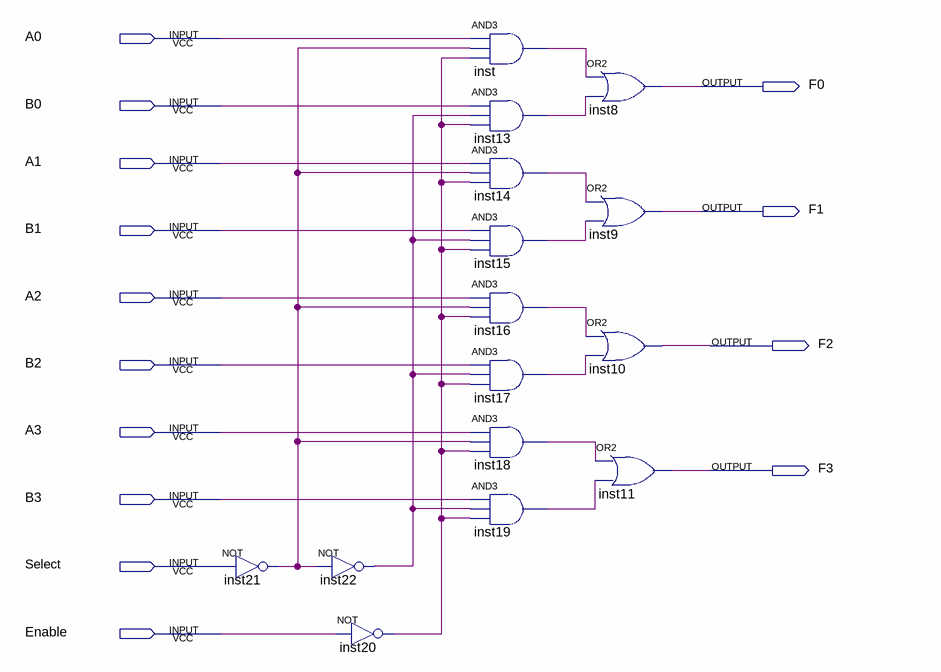
[diagram p0: schematic sheet]
// Quartus schematic quad_two_one_mux.bdf as structural Verilog: 15 symbols, 14 pins
module quad_two_one_mux (
  input  A0,
  input  B0,
  input  A1,
  input  B1,
  input  A2,
  input  B2,
  input  A3,
  input  B3,
  input  Select,
  input  Enable,
  output F0,
  output F1,
  output F2,
  output F3
);

  wire inst13_out, inst14_out, inst15_out, inst16_out, inst17_out, inst18_out, inst19_out, inst20_out,
       inst21_out, inst22_out, inst_out;

  not inst21 (inst21_out, Select);
  not inst22 (inst22_out, inst21_out);
  not inst20 (inst20_out, Enable);
  and inst (inst_out, A0, inst21_out, inst20_out);
  and inst13 (inst13_out, B0, inst22_out, inst20_out);
  and inst14 (inst14_out, A1, inst21_out, inst20_out);
  and inst15 (inst15_out, B1, inst22_out, inst20_out);
  and inst16 (inst16_out, A2, inst21_out, inst20_out);
  and inst17 (inst17_out, B2, inst22_out, inst20_out);
  and inst18 (inst18_out, A3, inst21_out, inst20_out);
  and inst19 (inst19_out, B3, inst22_out, inst20_out);
  or inst8 (F0, inst_out, inst13_out);
  or inst9 (F1, inst14_out, inst15_out);
  or inst10 (F2, inst16_out, inst17_out);
  or inst11 (F3, inst18_out, inst19_out);
endmodule
